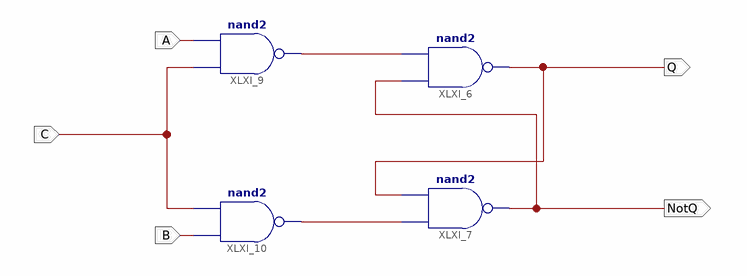
[diagram p0: schematic sheet 1]
// Xilinx ISE schematic SRLatch.sch (spartan6) as structural Verilog: 4 symbols, 5 ports
module SRLatch (
  input  A,
  input  B,
  input  C,
  output Q,
  output NotQ
);

  wire XLXN_6, XLXN_7;

  nand XLXI_6 (Q, NotQ, XLXN_6);
  nand XLXI_7 (NotQ, XLXN_7, Q);
  nand XLXI_9 (XLXN_6, C, A);
  nand XLXI_10 (XLXN_7, B, C);
endmodule
